# EAGLE design Zio 16 Servo Controller (EAGLE 8.4.1)
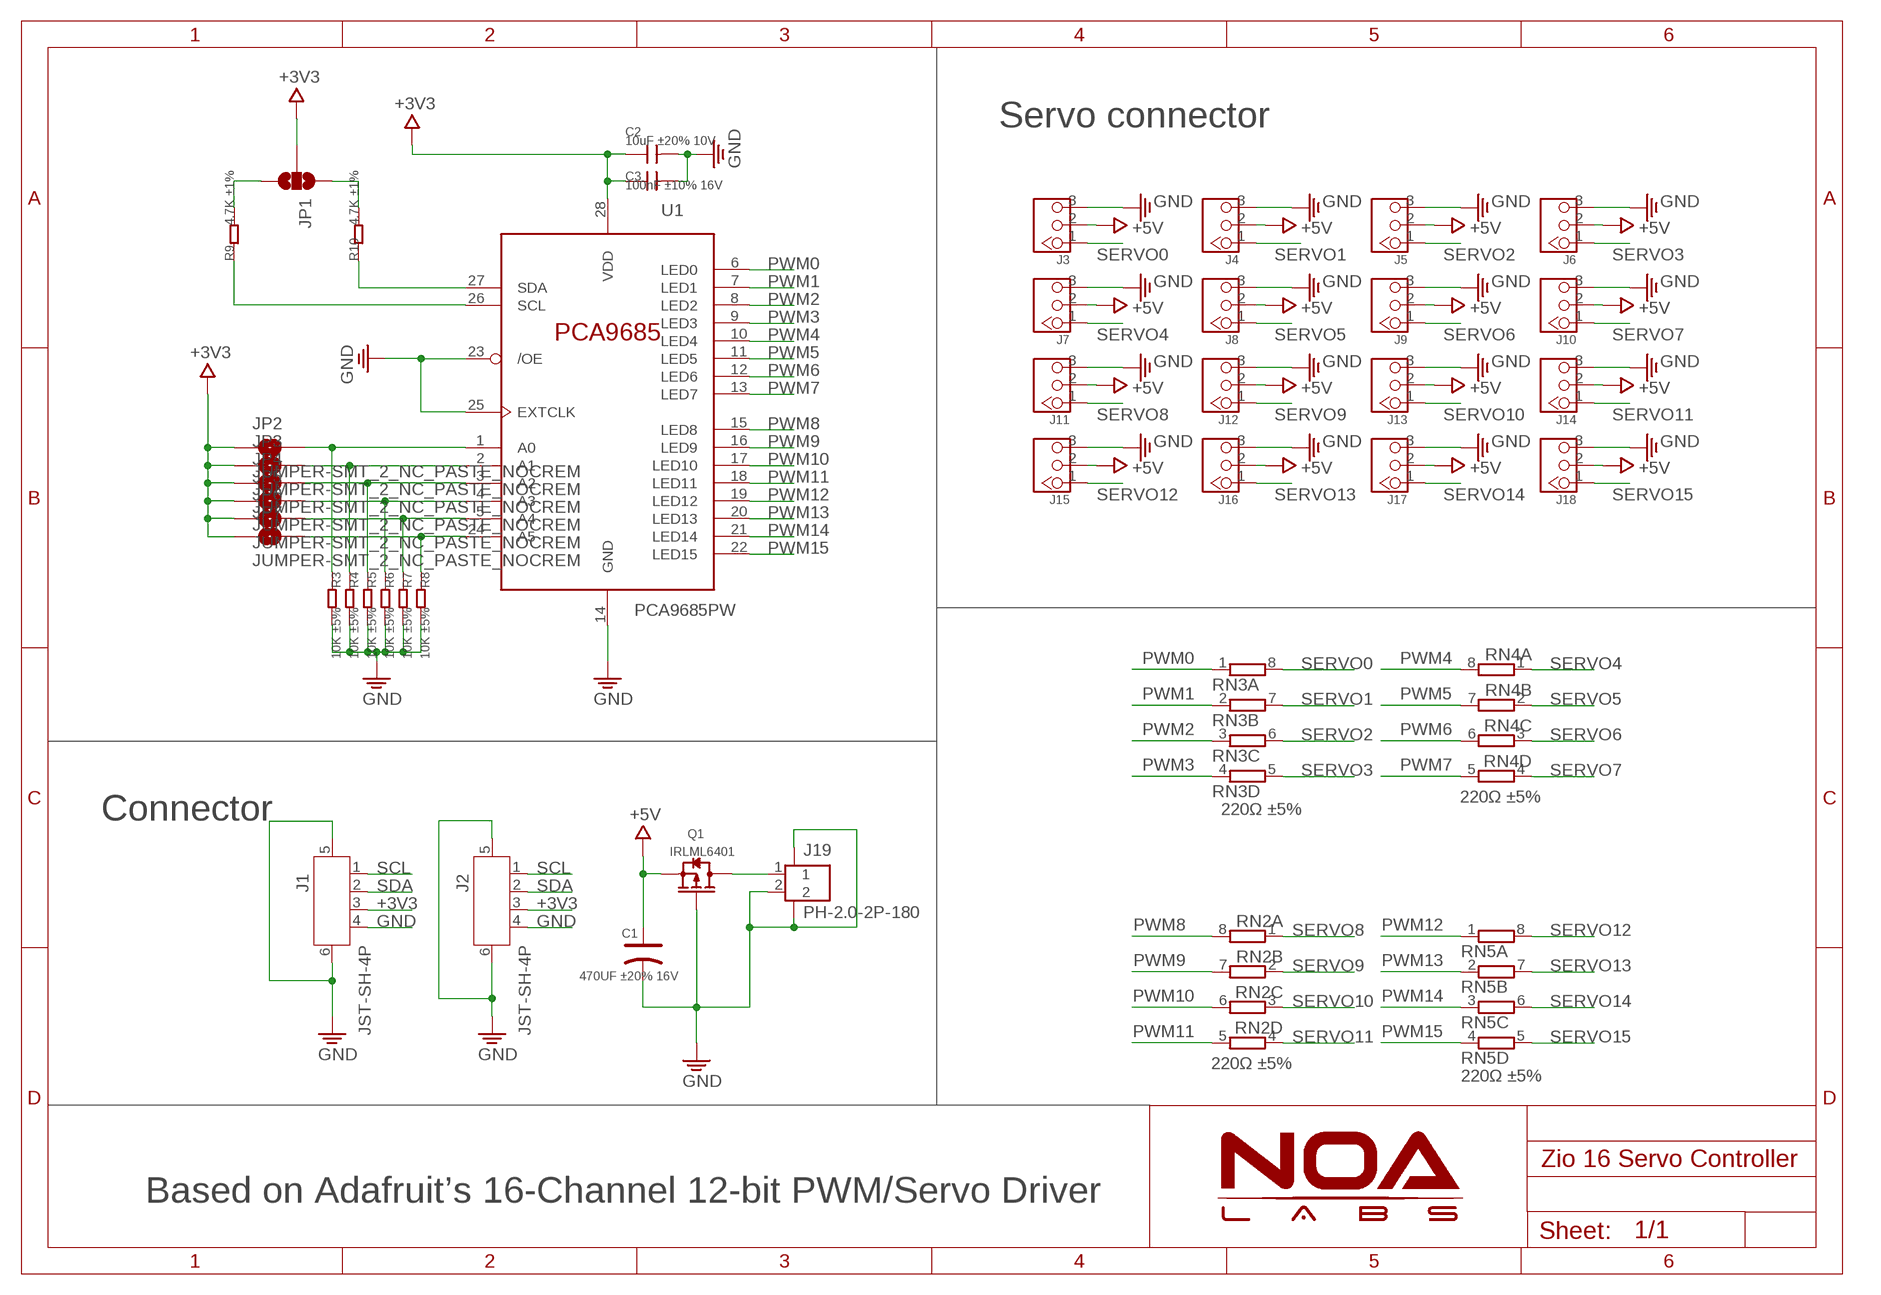
[diagram p0: schematic, sheet 1]

## Parts
C1  470UF ±20% 16V  CAP-ELECTRO-E  [ELECTRO-SMD-E-7.8MM]
C2  10uF ±20% 10V  C-0402  [0402]
C3  100nF ±10% 16V  C-0402  [0402]
J1  JST-SH-4P  [JST-SH-4P-90]
J2  JST-SH-4P  [JST-SH-4P-90]
J3  HEADER-3P-2.54  [3P-2.54]
J4  HEADER-3P-2.54  [3P-2.54]
J5  HEADER-3P-2.54  [3P-2.54]
J6  HEADER-3P-2.54  [3P-2.54]
J7  HEADER-3P-2.54  [3P-2.54]
J8  HEADER-3P-2.54  [3P-2.54]
J9  HEADER-3P-2.54  [3P-2.54]
J10  HEADER-3P-2.54  [3P-2.54]
J11  HEADER-3P-2.54  [3P-2.54]
J12  HEADER-3P-2.54  [3P-2.54]
J13  HEADER-3P-2.54  [3P-2.54]
J14  HEADER-3P-2.54  [3P-2.54]
J15  HEADER-3P-2.54  [3P-2.54]
J16  HEADER-3P-2.54  [3P-2.54]
J17  HEADER-3P-2.54  [3P-2.54]
J18  HEADER-3P-2.54  [3P-2.54]
J19  PH-2.0-2P-180  [PH2.0_2P_180]
JP1  JUMPER-SMT_3_2-NC_PASTE_NOCREM  [SMT-JUMPER_3_2-NC_PASTE_SILK_NOCREM]
JP2  JUMPER-SMT_2_NC_PASTE_NOCREM  [SMT-JUMPER_2_NC_PASTE_SILK_NOCREM]
JP3  JUMPER-SMT_2_NC_PASTE_NOCREM  [SMT-JUMPER_2_NC_PASTE_SILK_NOCREM]
JP4  JUMPER-SMT_2_NC_PASTE_NOCREM  [SMT-JUMPER_2_NC_PASTE_SILK_NOCREM]
JP5  JUMPER-SMT_2_NC_PASTE_NOCREM  [SMT-JUMPER_2_NC_PASTE_SILK_NOCREM]
JP6  JUMPER-SMT_2_NC_PASTE_NOCREM  [SMT-JUMPER_2_NC_PASTE_SILK_NOCREM]
JP7  JUMPER-SMT_2_NC_PASTE_NOCREM  [SMT-JUMPER_2_NC_PASTE_SILK_NOCREM]
Q1  IRLML6401  MOSFET-P-SOT23  [SOT23]
R3  10K ±5%  R-0402  [0402]
R4  10K ±5%  R-0402  [0402]
R5  10K ±5%  R-0402  [0402]
R6  10K ±5%  R-0402  [0402]
R7  10K ±5%  R-0402  [0402]
R8  10K ±5%  R-0402  [0402]
R9  4.7K ±1%  R-0402  [0402]
R10  4.7K ±1%  R-0402  [0402]
RN2  220Ω ±5%  RESISTOR-DIL_4R-N0603-ARV  [RESISTOR-DIL_0603-ARV]
RN3  220Ω ±5%  RESISTOR-DIL_4R-N0603-ARV  [RESISTOR-DIL_0603-ARV]
RN4  220Ω ±5%  RESISTOR-DIL_4R-N0603-ARV  [RESISTOR-DIL_0603-ARV]
RN5  220Ω ±5%  RESISTOR-DIL_4R-N0603-ARV  [RESISTOR-DIL_0603-ARV]
U1  PCA9685PW  [TSSOP28]

## Nets
+3V3: C2.1 C3.1 J1.3 J2.3 JP1.2 JP2.1 JP3.1 JP4.1 JP5.1 JP6.1 JP7.1 U1.28(VDD)
+5V: C1.+ J3.2 J4.2 J5.2 J6.2 J7.2 J8.2 J9.2 J10.2 J11.2 J12.2 J13.2 J14.2 J15.2 J16.2 J17.2 J18.2 Q1.2(S)
GND: C1.- C2.2 C3.2 J1.4 J1.5 J1.6 J2.4 J2.5 J2.6 J3.3 J4.3 J5.3 J6.3 J7.3 J8.3 J9.3 J10.3 J11.3 J12.3 J13.3 J14.3 J15.3 J16.3 J17.3 J18.3 J19.2 J19.3 J19.4 Q1.1(G) R3.2 R4.2 R5.2 R6.2 R7.2 R8.2 U1.14(GND) U1.23(/OE) U1.25(EXTCLK)
N$1: JP2.2 R3.1 U1.1(A0)
N$2: JP3.2 R4.1 U1.2(A1)
N$3: JP4.2 R5.1 U1.3(A2)
N$4: JP5.2 R6.1 U1.4(A3)
N$5: JP6.2 R7.1 U1.5(A4)
N$6: JP7.2 R8.1 U1.24(A5)
N$8: J19.1 Q1.3(D)
N$9: JP1.3 R9.2
N$10: JP1.1 R10.2
PWM0: RN3.1 U1.6(LED0)
PWM1: RN3.2 U1.7(LED1)
PWM2: RN3.3 U1.8(LED2)
PWM3: RN3.4 U1.9(LED3)
PWM4: RN4.8 U1.10(LED4)
PWM5: RN4.7 U1.11(LED5)
PWM6: RN4.6 U1.12(LED6)
PWM7: RN4.5 U1.13(LED7)
PWM8: RN2.8 U1.15(LED8)
PWM9: RN2.7 U1.16(LED9)
PWM10: RN2.6 U1.17(LED10)
PWM11: RN2.5 U1.18(LED11)
PWM12: RN5.1 U1.19(LED12)
PWM13: RN5.2 U1.20(LED13)
PWM14: RN5.3 U1.21(LED14)
PWM15: RN5.4 U1.22(LED15)
SCL: J1.1 J2.1 R9.1 U1.26(SCL)
SDA: J1.2 J2.2 R10.1 U1.27(SDA)
SERVO0: J3.1 RN3.8
SERVO1: J4.1 RN3.7
SERVO2: J5.1 RN3.6
SERVO3: J6.1 RN3.5
SERVO4: J7.1 RN4.1
SERVO5: J8.1 RN4.2
SERVO6: J9.1 RN4.3
SERVO7: J10.1 RN4.4
SERVO8: J11.1 RN2.1
SERVO9: J12.1 RN2.2
SERVO10: J13.1 RN2.3
SERVO11: J14.1 RN2.4
SERVO12: J15.1 RN5.8
SERVO13: J16.1 RN5.7
SERVO14: J17.1 RN5.6
SERVO15: J18.1 RN5.5

## Notes on the sheet
- Servo connector
- Connector
- Based on Adafruit’s 16-Channel 12-bit PWM/Servo Driver

## Library data of the parts
C1 = Discrete:CAP*: Electrolytic Capacitors,Tantalum Capacitors and Super Capacitors
C2 C3 = Discrete:C*: Ceramic Capacitors
J1 J2 = Connector:JST-SH-4P
J3-J18 = Connector:HEADER-3P
J19 = Connector:PH-2.0-2P
JP1 = NOA-Jumpers:JUMPER-SMT_3_2-NC_PASTE_NOCREM
JP2-JP7 = NOA-Jumpers:JUMPER-SMT_2_NC_PASTE_NOCREM
Q1 = Discrete:MOSFET-P
R3-R8 = Discrete:R*
R9 R10 = Discretex:R*
RN2-RN5 = A:RESISTOR-DIL_4R-N: Array Chip Resistor Source: RS Component / Phycomp
U1 = IC:PCA9685

## Board
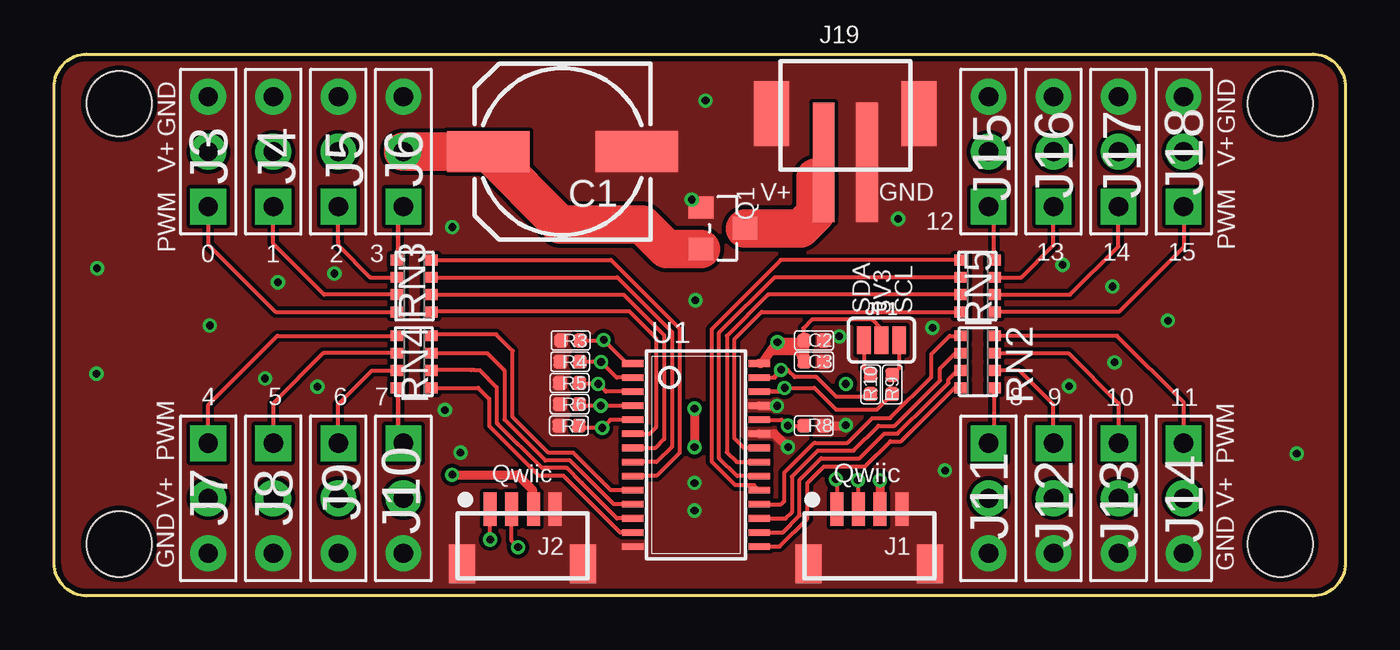
[diagram p1: board, top side]
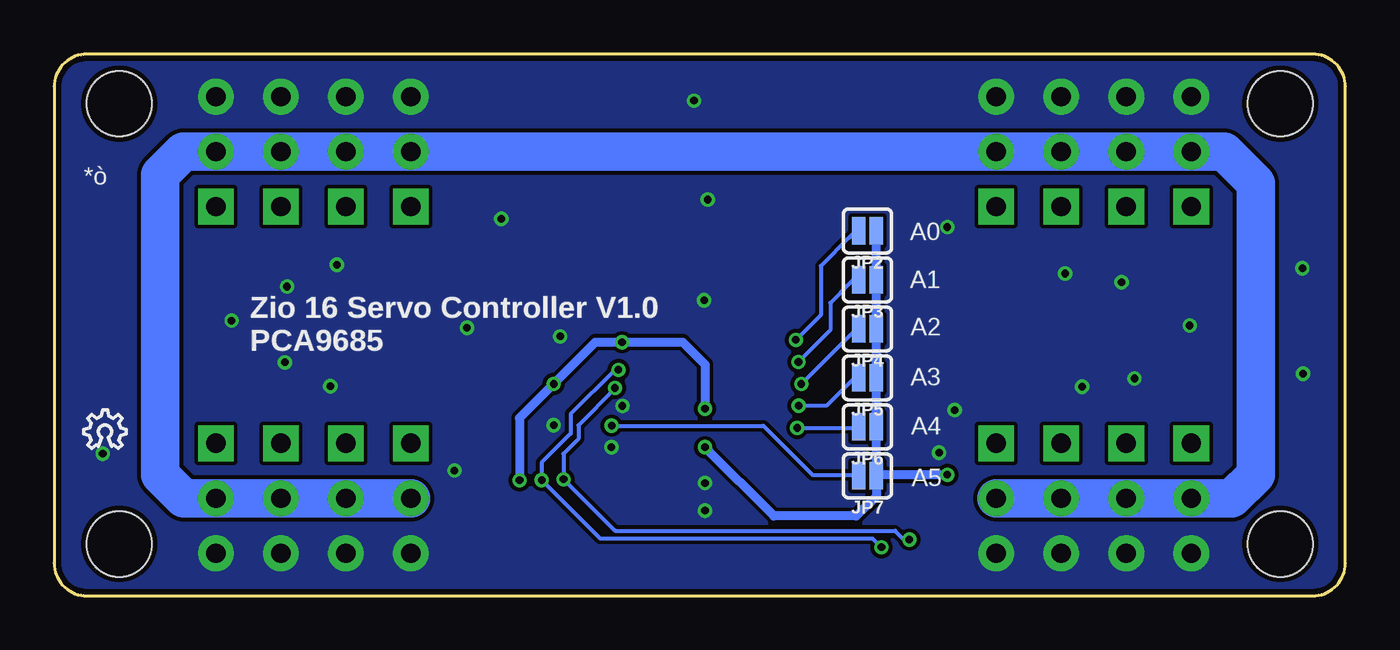
[diagram p2: board, bottom side, seen from below]

Size 59.57 x 25 mm. Coordinates in mm from the lower left corner, seen from the top.
Outline: 59.57,23.5 59.57,1.5 arc-90 58.07,0 1.5,0 arc-90 0,1.5 0,23.5 arc-90 1.5,25 58.07,25 arc-90 59.57,23.5
Copper layers (1*16): Top 0.035mm / dielectric 1.5mm / Bottom 0.035mm
Design rules "NOA Eagle Rule *": minimum track width 7mil, minimum drill 12mil, track to track 7mil, track to pad 7mil, pad to pad 7mil, via to via 7mil, smd to smd 0mil, copper to edge 10mil, drill to drill 10mil, minimum pad ring 10mil, minimum via ring 6mil, stop-mask expansion 2mil, vias tented up to drill 25mil, thermal gap 10mil
Holes 3 mm at 3,2.39 3,22.71 56.57,2.39 56.57,22.71

### Footprints (pad centres in the part's own frame; a part is rotated, then mirrored left to right if it is on the bottom)
ELECTRO-SMD-E-7.8MM = smd 3.81 x 1.905: + 3.429,0; - -3.429,0
0402 = smd 0.635 x 0.635: 1 -0.445,0; 2 0.445,0
JST-SH-4P-90 = smd 0.6 x 1.55: 1 1.5,0; 2 0.5,0; 3 -0.5,0; 4 -1.5,0 | smd 1.2 x 1.8: 5 -2.8,2.525; 6 2.8,2.525
3P-2.54 = drill 0.889 pad 1.651 square: 1 0,2.54 | drill 0.889 pad 1.651: 2 0,0; 3 0,-2.54
PH2.0_2P_180 = smd 1 x 5.5: 1 -1,0; 2 1,0 | smd 1.6 x 3: 3 3.4,2.25; 4 -3.4,2.25
SMT-JUMPER_3_2-NC_PASTE_SILK_NOCREM = smd 0.635 x 1.27: 1 -0.813,0; 2 0,0; 3 0.813,0
SMT-JUMPER_2_NC_PASTE_SILK_NOCREM = smd 0.635 x 1.27: 1 -0.406,0; 2 0.406,0
SOT23 = smd 1.016 x 1.143: 1 -0.95,-1.016; 2 0.95,-1.016; 3 0,1.016
RESISTOR-DIL_0603-ARV = smd 0.5 x 0.65: 1 -1.2,-0.752; 2 -0.4,-0.752; 3 0.4,-0.752; 4 1.2,-0.752; 5 1.2,0.752; 6 0.4,0.752; 7 -0.4,0.752; 8 -1.2,0.752
TSSOP28 = smd 0.305 x 0.991: 1 -4.225,-2.918; 2 -3.575,-2.918; 3 -2.925,-2.918; 4 -2.275,-2.918; 5 -1.625,-2.918; 6 -0.975,-2.918; 7 -0.325,-2.918; 8 0.325,-2.918; 9 0.975,-2.918; 10 1.625,-2.918; 11 2.275,-2.918; 12 2.925,-2.918; 13 3.575,-2.918; 14 4.225,-2.918; 15 4.225,2.918; 16 3.575,2.918; 17 2.925,2.918; 18 2.275,2.918; 19 1.625,2.918; 20 0.975,2.918; 21 0.325,2.918; 22 -0.325,2.918; 23 -0.975,2.918; 24 -1.625,2.918; 25 -2.275,2.918; 26 -2.925,2.918; 27 -3.575,2.918; 28 -4.225,2.918

### Placement (x,y rotation side)
C1  23.45,20.5 180 top
C2  35.05,11.78 0 top
C3  35.05,10.8 0 top
E$4  [7MM]  21.16,20.95 0 bottom
J1  37.61,4 180 top
J2  21.61,4 180 top
J3  7.11,20.5 180 top
J4  10.11,20.5 180 top
J5  13.11,20.5 180 top
J6  16.11,20.5 180 top
J7  7.11,4.5 0 top
J8  10.11,4.5 0 top
J9  13.11,4.5 0 top
J10  16.11,4.5 0 top
J11  43.11,4.5 0 top
J12  46.11,4.5 0 top
J13  49.11,4.5 0 top
J14  52.11,4.5 0 top
J15  43.11,20.5 180 top
J16  46.11,20.5 180 top
J17  49.11,20.5 180 top
J18  52.11,20.5 180 top
J19  36.5,20 0 top
JP1  38.17,11.8 0 top
JP2  22.05,16.84 180 bottom
JP3  22.05,14.58 180 bottom
JP4  22.05,12.32 180 bottom
JP5  22.05,10.06 180 bottom
JP6  22.05,7.8 180 bottom
JP7  22.05,5.54 180 bottom
LOGO1  LOGO-OSHW-6MILX0070-NT  [OSHW_6X70_NOTEXT]  58.22,6.8 0 bottom
Q1  30.86,16.96 270 top
R3  23.83,11.78 180 top
R4  23.8,10.8 180 top
R5  23.78,9.82 180 top
R6  23.78,8.85 180 top
R7  23.75,7.85 180 top
R8  35.05,7.85 0 top
R9  38.67,9.76 90 top
R10  37.67,9.76 90 top
RN2  42.61,10.8 90 top
RN3  16.61,14.3 90 top
RN4  16.61,10.8 270 top
RN5  42.61,14.3 270 top
U1  29.61,6.5 270 top
U$21  [6MM]  8.53,10.79 0 top

### Tracks (layer width: path | path; a pad name or v marks a point on that pad's centre or on a via)
+3V3  (via drill 0.35)
  Top 0.178: 34.6,11.68 34.57,11.72 34.57,12.34 34.97,12.74 37.74,12.74 38.17,12.32 JP1.2
  Top 0.406: 34.61,11.69 C3.1 34.61,10.98 34.27,11.31 | C2.1 34.61,11.69 | U1.28 32.65,10.72 33.08,11.31 | 33.08,11.31 v33.37,11.71 | v33.37,11.71 33.6,11.68 33.9,11.68 | 33.9,11.68 34.6,11.68 34.61,11.69 | 34.27,11.31 34.26,11.32 | 34.26,11.32 33.9,11.68 | 34.26,11.32 v33.37,11.71 | 33.08,11.31 34.27,11.31 | 36.48,9.82 v36.53,9.78 | v29.54,8.64 v29.54,6.86 | v38.1,5.33 v38.11,5.32 J1.3 | J2.3 22.07,4.04 22.07,4.9 21.38,5.59 v18.36,5.59
  Bottom 0.406: v36.53,9.78 34.6,11.71 v33.37,11.71 30.58,11.71 29.54,10.67 v29.54,8.64 | v36.53,9.78 36.53,9.74 | v29.54,6.86 26.37,3.68 22.56,3.68 21.64,4.6 JP7.1 | v36.53,9.78 38.1,8.21 v38.1,5.33 | JP7.1 JP6.1 JP5.1 JP4.1 JP3.1 JP2.1 | v18.36,5.59 21.59,5.59 JP7.1
+5V
  Top 1.778: Q1.2 28.26,16.01 27.13,17.14 23.35,17.14 20.02,20.47 C1.+ J6.2
  Bottom 0.406: J8.2 | J16.2 49.02,20.5 | 46.05,4.5 J12.2 | J13.2 | J4.2 10.24,20.5 | J9.2 13.16,4.5 | J5.2 13.03,20.5
  Bottom 1.778: J10.2 13.16,4.5 J8.2 J7.2 5.23,4.5 4.14,5.59 4.14,19.05 5.59,20.5 J3.2 10.24,20.5 13.03,20.5 J6.2 J15.2 49.02,20.5 J17.2 J18.2 53.62,20.5 54.69,19.43 54.69,5.59 53.6,4.5 J14.2 J13.2 J12.2 J11.2
GND  (via drill 0.35)
  Top 0.406: U1.25 33.34,8.78 v33.35,8.76 | U1.23 33.23,7.47 33.56,7.14 33.57,7.14 v33.86,6.86 | R8.2 36.5,7.85 v36.53,7.87
  other vias: 51.38,12.7 57.33,6.56 38.94,17.4 30.05,22.86 18.36,17.02 1.95,10.25 9.73,10.03 12.14,9.65 18.75,6.6 41.1,5.78 7.18,12.48 1.98,15.11 29.58,13.64 29.54,5.21 29.54,3.94 29.41,18.29 36.23,11.97 40.53,12.37 46.83,9.67 48.93,10.77 48.83,14.27 46.53,15.27 18.03,8.57 10.33,14.47 12.93,14.87
  pour Top (no thermals): 58.07,25 1.5,25 arc90 0,23.5 0,1.5 arc90 1.5,0 58.07,0 arc90 59.57,1.5 59.57,23.5 arc90
  pour Bottom (no thermals): 58.07,25 1.5,25 arc90 0,23.5 0,1.5 arc90 1.5,0 58.07,0 arc90 59.57,1.5 59.57,23.5 arc90
N$1  (via drill 0.35)
  Top 0.178: U1.1 26.44,10.72 25.38,11.79 | 25.38,11.79 v25.35,11.81 | R3.1 25.38,11.79
  Bottom 0.178: 22.87,16.55 22.81,16.61 | 22.87,16.55 24.19,15.23 24.19,12.97 v25.35,11.81 | JP2.2 22.58,16.84 22.87,16.55
N$2  (via drill 0.35)
  Top 0.178: R4.1 v25.23,10.79 25.95,10.07 U1.2
  Bottom 0.178: 22.87,14.41 22.81,14.48 | 22.87,14.41 23.76,13.53 23.76,12.26 v25.23,10.79 | JP3.2 22.71,14.58 22.87,14.41
N$3  (via drill 0.35)
  Top 0.178: R5.1 24.26,9.78 v25.1,9.78 25.45,9.43 U1.3
  Bottom 0.178: JP4.2 22.56,12.32 v25.1,9.78
N$4  (via drill 0.35)
  Top 0.178: R6.1 24.29,8.78 v25.22,8.78 U1.4
  Bottom 0.178: v25.22,8.78 23.94,8.78 22.66,10.06 JP5.2
N$5  (via drill 0.35)
  Top 0.178: R7.1 24.3,7.75 v25.29,7.75 25.66,8.12 U1.5
  Bottom 0.178: JP6.2 22.5,7.75 v25.29,7.75
N$6  (via drill 0.35)
  Top 0.178: 34.59,7.87 R8.1 v33.85,7.85 33.58,8.12 U1.24
  Bottom 0.178: v33.85,7.85 26.85,7.85 24.59,5.59 22.5,5.59 JP7.2
N$8
  Top 0.406: J19.1 35.5,19.67 35.13,19.3
  Top 1.778: Q1.3 34.44,16.96 35.13,17.65 35.13,19.3
N$9
  Top 0.178: R9.2 38.98,10.51 JP1.3
N$10
  Top 0.178: R10.2 37.36,10.51 JP1.1
PWM0
  Top 0.178: U1.6 27.47,7.47 27.79,7.8 27.79,11.89 26.54,13.13 17.27,13.13 RN3.1
PWM1
  Top 0.178: RN3.2 26.28,13.9 28.14,12.03 28.14,7.24 27.71,6.81 26.71,6.81 U1.7
PWM2
  Top 0.178: RN3.3 25.98,14.7 28.5,12.18 28.5,6.88 27.79,6.17 U1.8
PWM3
  Top 0.178: RN3.4 25.68,15.5 28.85,12.33 28.85,6.6 27.79,5.54 26.7,5.54 U1.9
PWM4
  Top 0.178: U1.10 25.68,4.88 23.95,6.6 22.81,6.6 21.16,8.26 21.16,11.3 20.4,12.06 17.3,12.06 RN4.8
PWM5
  Top 0.178: U1.11 25.83,4.22 23.81,6.25 22.66,6.25 20.78,8.13 20.78,10.4 19.98,11.2 RN4.7
PWM6
  Top 0.178: U1.12 25.97,3.58 24.33,5.21 24.33,5.22 23.66,5.89 22.51,5.89 20.47,7.94 20.42,7.99 20.42,9.63 19.63,10.41 19.38,10.41 19.25,10.41 17.25,10.41 RN4.6
PWM7
  Top 0.178: RN4.5 19.56,9.6 20.07,9.09 20.07,7.84 22.37,5.54 23.5,5.54 26.11,2.92 U1.13
PWM8
  Top 0.178: U1.15 33.47,2.27 34.75,3.56 34.75,5.21 35.51,5.97 37.42,5.97 38.58,7.13 39.07,7.13 41.53,9.59 41.98,9.59 RN2.8
PWM9
  Top 0.178: U1.16 33.61,2.92 34.39,3.7 34.39,5.36 35.38,6.35 37.16,6.35 38.3,7.49 38.92,7.49 40.4,8.97 41.26,9.83 41.26,10 41.63,10.36 41.82,10.36 RN2.7 41.93,10.34 41.77,10.34
PWM10
  Top 0.178: U1.17 33.75,3.58 34.04,3.86 34.04,5.51 35.19,6.67 35.2,6.67 35.24,6.71 36.88,6.71 38.02,7.84 38.77,7.84 40.87,9.95 40.87,10.49 41.58,11.2 41.83,11.2 | 41.83,11.2 RN2.6 | 41.83,11.2
PWM11
  Top 0.178: U1.18 33.54,4.22 33.68,4.37 33.68,5.66 35.06,7.05 35.08,7.05 35.09,7.06 36.6,7.06 37.74,8.2 38.57,8.2 40.46,10.09 40.46,11.15 41.31,12 RN2.5
PWM12
  Top 0.178: U1.19 32.3,5.11 31.42,5.11 30.33,6.2 30.33,12.3 33.53,15.5 RN5.1
PWM13
  Top 0.178: RN5.2 33.23,14.7 30.68,12.15 30.68,6.35 31.51,5.53 U1.20
PWM14
  Top 0.178: U1.21 31.49,6.17 31.04,6.63 31.04,12 32.94,13.9 RN5.3
PWM15
  Top 0.178: RN5.4 32.64,13.1 31.39,11.86 31.39,7.26 31.83,6.83 U1.22
SCL  (via drill 0.35)
  Top 0.178: 33.78,9.43 U1.26 33.52,9.43 v33.7,9.6 | v33.7,9.6 33.7,9.51 | v33.7,9.6 35.07,9.6 36.07,8.6 37.96,8.6 R9.1 | v36.07,5.38 36.11,5.34 J1.1 | v20.12,2.59 20.11,2.6 J2.1
  Bottom 0.178: v33.7,9.6 33.7,9.56 35.38,7.87 35.38,7.24 36.07,6.55 v36.07,5.38 33.69,3 20.77,3 20.36,2.59 v20.12,2.59
SDA  (via drill 0.35)
  Top 0.178: v33.53,10.43 33.18,10.07 U1.27 33.24,10.07 33.36,10.19 33.55,10.19 33.53,10.21 v33.53,10.43 | v33.53,10.43 33.84,10.43 34.17,10.1 35.17,10.1 36.08,9.19 37.54,9.19 R10.1 | v37.08,5.34 37.08,4.03 J1.2 | v21.4,2.24 21.11,2.53 J2.2
  Bottom 0.178: v33.53,10.43 33.7,10.43 35.74,8.39 35.74,7.49 37.08,6.16 v37.08,5.34 34.38,2.64 21.81,2.64 v21.4,2.24
SERVO0
  Top 0.178: RN3.8 10.22,13.1 7.11,16.21 J3.1
SERVO1
  Top 0.178: RN3.7 12.47,13.9 10.11,16.26 J4.1
SERVO2
  Top 0.178: J5.1 13.11,16.38 13.11,16.3 13.11,16.18 14.59,14.7 RN3.6
SERVO3
  Top 0.203: RN3.5 15.86,17.71 J6.1
SERVO4
  Top 0.178: RN4.1 10.3,12 7.11,8.81 J7.1
SERVO5
  Top 0.178: RN4.2 12.42,11.2 10.11,8.89 J8.1
SERVO6
  Top 0.178: RN4.3 14.67,10.4 13.11,8.84 J9.1
SERVO7
  Top 0.203: RN4.4 15.86,7.29 J10.1
SERVO8
  Top 0.178: RN2.1 43.36,7.29 J11.1
SERVO9
  Top 0.178: RN2.2 44.54,10.4 46.11,8.83 J12.1
SERVO10
  Top 0.178: RN2.3 46.79,11.2 49.1,8.89 J13.1
SERVO11
  Top 0.178: RN2.4 49.04,12 52.11,8.93 J14.1
SERVO12
  Top 0.178: RN5.8 43.36,17.71 J15.1
SERVO13
  Top 0.178: J16.1 46.11,16.19 44.62,14.7 RN5.7
SERVO14
  Top 0.178: RN5.6 46.87,13.9 49.1,16.13 J17.1
SERVO15
  Top 0.178: RN5.5 49.12,13.1 52.11,16.09 J18.1

### Text on the board
tPlace: GND | GND | V+ | V+ | PWM | V+ | GND | PWM | 12 | 0 | 1 | 2 | 3 | 13 | 14 | 15 | SDA | 3V3 | SCL | 4 | 5 | 6 | 7 | 8 | 9 | 10 | 11 | PWM | PWM | Qwiic | Qwiic | V+ | V+ | GND | GND
bPlace: *ò | A0 | A1 | A2 | Zio 16 Servo Controller V1.0 / PCA9685 | A3 | A4 | A5